# Altium schematic sheet Light_And_Battery_Monitoring.SchDoc
size A4; SheetNumber: 7; SheetTotal: 8
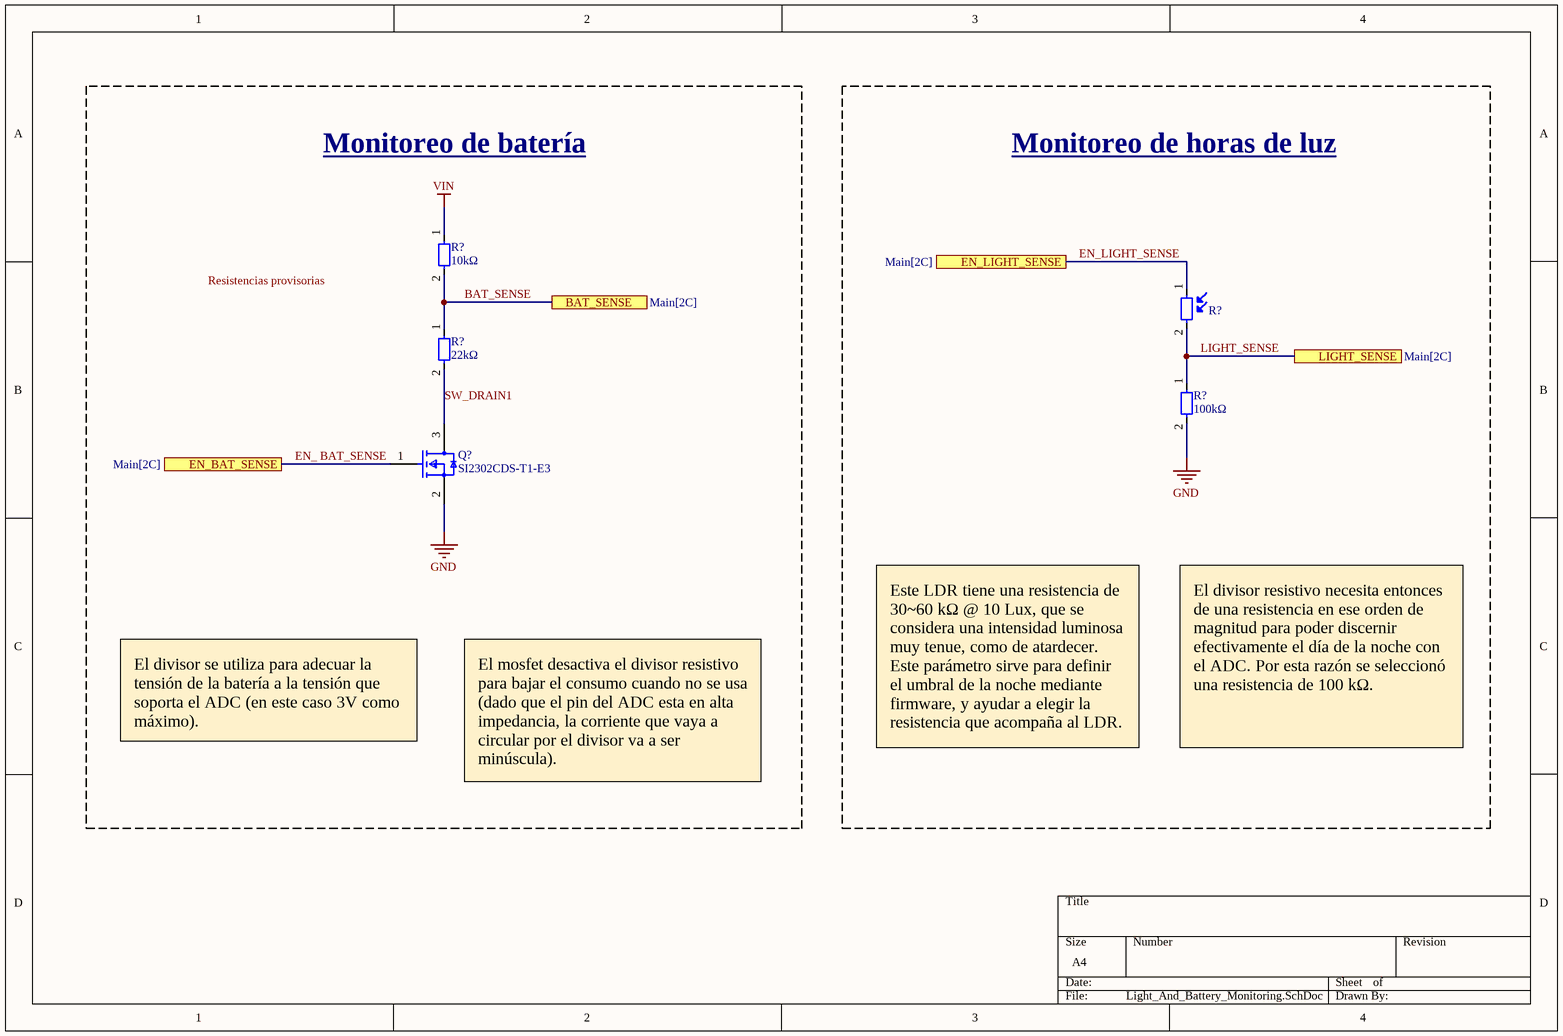
[diagram p0: Light_And_Battery_Monitoring.SchDoc]

## Parts
(Parts that share a designator on the sheet are numbered #1, #2 ... from top to bottom, then left to right.)
Q?  SI2302CDS-T1-E3  [FP-S-03946-MFG]
R?#1  value 10kΩ  [PACKAGE_0805]  (hidden comment: Simbolo de resistencia genérica)
R?#2  Simbolo de LDR genérico  [Generic LDR]  (value not drawn)
R?#3  value 22kΩ  [PACKAGE_0805]  (hidden comment: Simbolo de resistencia genérica)
R?#4  value 100kΩ  [PACKAGE_0805]  (hidden comment: Simbolo de resistencia genérica)

## Blocks framed on the sheet
Monitoreo de batería: Q? R?#1 R?#3
Monitoreo de horas de luz: R?#2 R?#4

## Ports
BAT_SENSE (see Main[2C]), EN_BAT_SENSE (see Main[2C]), EN_LIGHT_SENSE (see Main[2C]), LIGHT_SENSE (see Main[2C])

## Nets
GND: Q?.2(S) R?#4.2
VIN: R?#1.1
BAT_SENSE: R?#1.2 R?#3.1 ; port BAT_SENSE
EN_ BAT_SENSE: Q?.1(G) ; port EN_BAT_SENSE
EN_LIGHT_SENSE: R?#2.1 ; port EN_LIGHT_SENSE
LIGHT_SENSE: R?#2.2 R?#4.1 ; port LIGHT_SENSE
SW_DRAIN1: Q?.3(D) R?#3.2

## Notes on the sheet
- Resistencias provisorias
- El divisor se utiliza para adecuar la tensión de la batería a la tensión que soporta el ADC (en este caso 3V como máximo).
- El mosfet desactiva el divisor resistivo para bajar el consumo cuando no se usa (dado que el pin del ADC esta en alta impedancia, la corriente que vaya a circular por el divisor va a ser minúscula).
- Este LDR tiene una resistencia de 30~60 kΩ @ 10 Lux, que se considera una intensidad luminosa muy tenue, como de atardecer. Este parámetro sirve para definir el umbral de la noche mediante firmware, y ayudar a elegir la resistencia que acompaña al LDR.
- El divisor resistivo necesita entonces de una resistencia en ese orden de magnitud para poder discernir efectivamente el día de la noche con el ADC. Por esta razón se seleccionó una resistencia de 100 kΩ.

## Library data of the parts
Q? = CMP-02550-000184-1: MOSFET N-CH 20V 2.6A SOT-23; Manufacturer: Vishay; Gate To Source Voltage: 8V; Max Forward Diode Voltage: 1.2V; Pulse Drain Current: 10A; Typ Forward Diode Voltage: 0.7V; Number Of N Channels: 1; Reverse Recovery Charge: 2nC; Power Dissipation: 0.71W; Reverse Recovery Time: 8.5ns; Threshold Vgs Min: 0.4V; Drain To Source Resistance: 0.045Ω; Gate Charge At Vgs: 3.5nC @ 4.5V; Turn Off Delay Time: 30ns; Rthja Max: 140°C/W; Max Junction Temp: +150°C; Transconductance: 13S; Depletion Mode: False; Standoff Height: 0.01mm; Turn On Delay Time: 8ns; Threshold Vgs Max: 0.85V; Manufacturer Part Number: SI2302CDS-T1-E3; Mouser Description: MOSFET 20V 2.9A 0.86W 57mohm @ 4.5V; Digikey Description: MOSFET N-CH 20V 2.6A SOT-23; Drain To Source Voltage: 20V; Lead Free: Yes; Temperature Range High: +150°C; Automotive: No; ComponentLink2URL: http://www.vishay.com/docs/68645/si2302cds.pdf; Height: 1.12mm; ComponentLink2Description: Datasheet; Octopart: https://octopart.com/si2302cds-t1-e3-vishay-44452855; Continuous Drain Current: 2.6A; Drain To Source Breakdown Voltage: 20V; Number Of Channels: 1; Device Class L3: MOSFETs; Device Class L1: Discrete Semiconductors; Temperature Range Low: -55°C; Package: S-03946; RoHS: TRUE; Device Class L2: Transistors; Temperature: -55°C to +150°C; Category: Trans
R?#1 R?#3 R?#4 = Generic R
R?#2 = Generic LDR: Light Resistance: 30kΩ - 60 kΩ  @ 10 Lux; Dark Resistance: 10MΩ; Spectral Response Range: 400-700nm; Diameter: 5mm